# Altium schematic sheet QUTMS-BrakeLight-S00-V01.SchDoc: Brake Light
size A3; Author: Joseph Richards; DrawnBy: Joseph Richards; Engineer: Joseph Richards; Organization: QUTMS; DocumentNumber: 1; Revision: 2; SheetNumber: 1; SheetTotal: 3
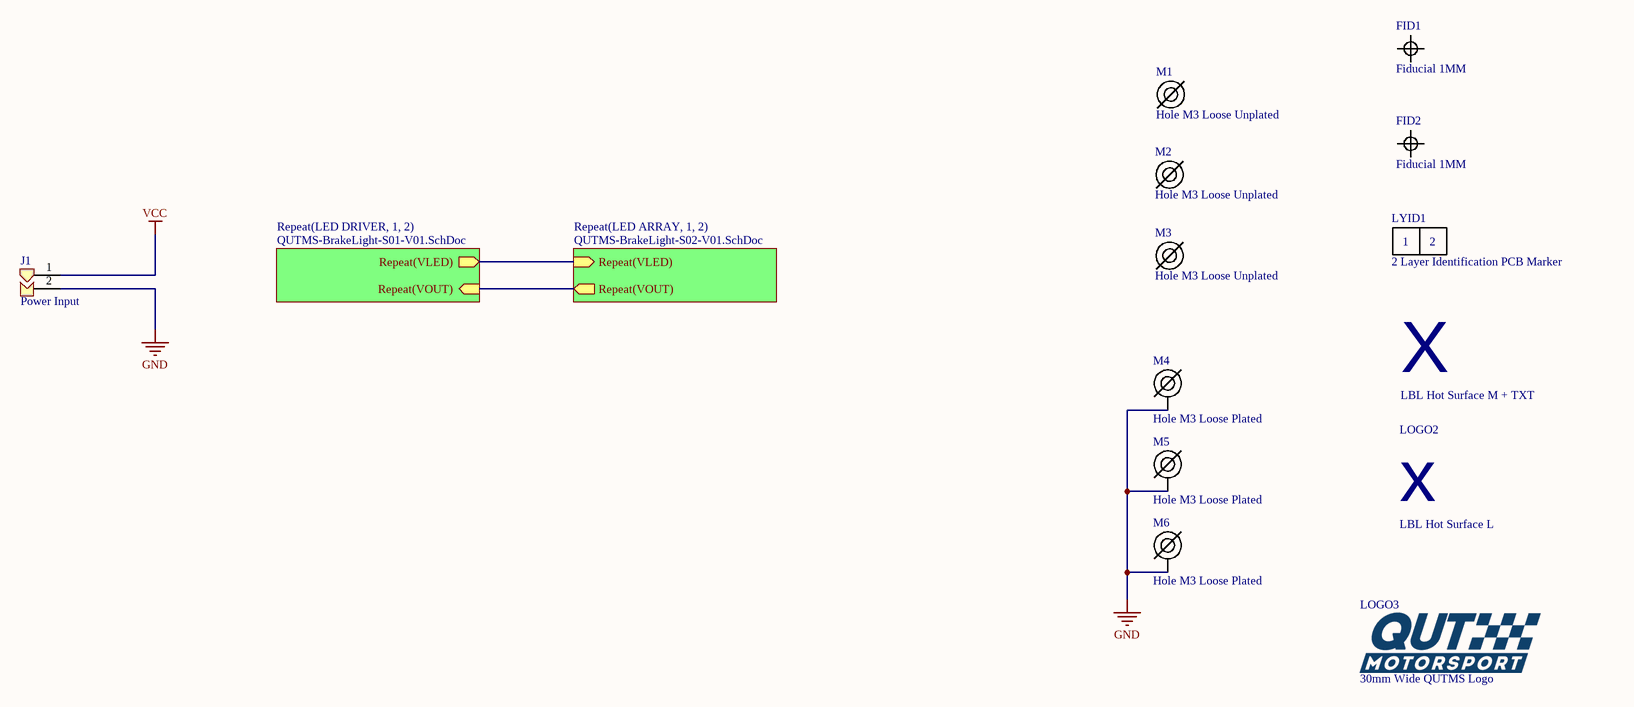
[diagram p0: QUTMS-BrakeLight-S00-V01.SchDoc]

## Parts
FID1  Fiducial 1MM  [FIDUCIAL 1MM]
FID2  Fiducial 1MM  [FIDUCIAL 1MM]
J1  Power Input  [Jumper_2Way_Large_Solder_Pad]
LOGO1  LBL Hot Surface M + TXT  [LBL HOT MEDIUM TXT]
LOGO2  LBL Hot Surface L  [LBL HOT LARGE]
LOGO3  30mm Wide QUTMS Logo  [QUTMS LOGO 30MM]
LYID1  2 Layer Identification PCB Marker  [LAYER IDENT 2]
M1  Hole M3 Loose Unplated  [M3.5 UNPLATED]
M2  Hole M3 Loose Unplated  [M3.5 UNPLATED]
M3  Hole M3 Loose Unplated  [M3.5 UNPLATED]
M4  Hole M3 Loose Plated  [M3.5 PLATED]
M5  Hole M3 Loose Plated  [M3.5 PLATED]
M6  Hole M3 Loose Plated  [M3.5 PLATED]

## Sub-sheets
Repeat(LED ARRAY, 1, 2) = QUTMS-BrakeLight-S02-V01.SchDoc: Repeat(VOUT) (out), Repeat(VLED) (in)
Repeat(LED DRIVER, 1, 2) = QUTMS-BrakeLight-S01-V01.SchDoc: Repeat(VLED) (out), Repeat(VOUT) (in)

## Nets
GND: J1.2 M4.1 M5.1 M6.1
VCC: J1.1
(unnamed): sheet Repeat(LED DRIVER, 1, 2)/Repeat(VLED), sheet Repeat(LED ARRAY, 1, 2)/Repeat(VLED)
(unnamed): sheet Repeat(LED DRIVER, 1, 2)/Repeat(VOUT), sheet Repeat(LED ARRAY, 1, 2)/Repeat(VOUT)

## Notes on the sheet
- Revision History:
- Sheet Title:
- Rev
- Date
- Description
- Project:
- Size:
- Drawn By:
- A3
- Number:
- Revision:
- Sheet
- Version:
- of
- QUT Motorsport
- O-120, Gardens Point
- 2 George Street
- Brisbane, QLD 4000
- Australia
- Print Date:
- Print Time:
- File Name:
- (in symbol Layer Identification 2) 1; 2
- (in symbol LBL Hot Surface L) x
- (in symbol LBL Hot Surface M + TXT) X

## Library data of the parts
J1 = Jumper 2Way Side Large Solder Pad: Jumper 2Way Side Large Solderable Pad
LOGO3 = QUTMS Logo 30mm
LYID1 = Layer Identification 2
M1-M3 = Hole M3 Loose Unplated: M3.5 Hole, No Plating
M4-M6 = Hole M3 Loose Plated: M3.5 Hole, Plated